# EAGLE design cmoy (EAGLE 4.16)
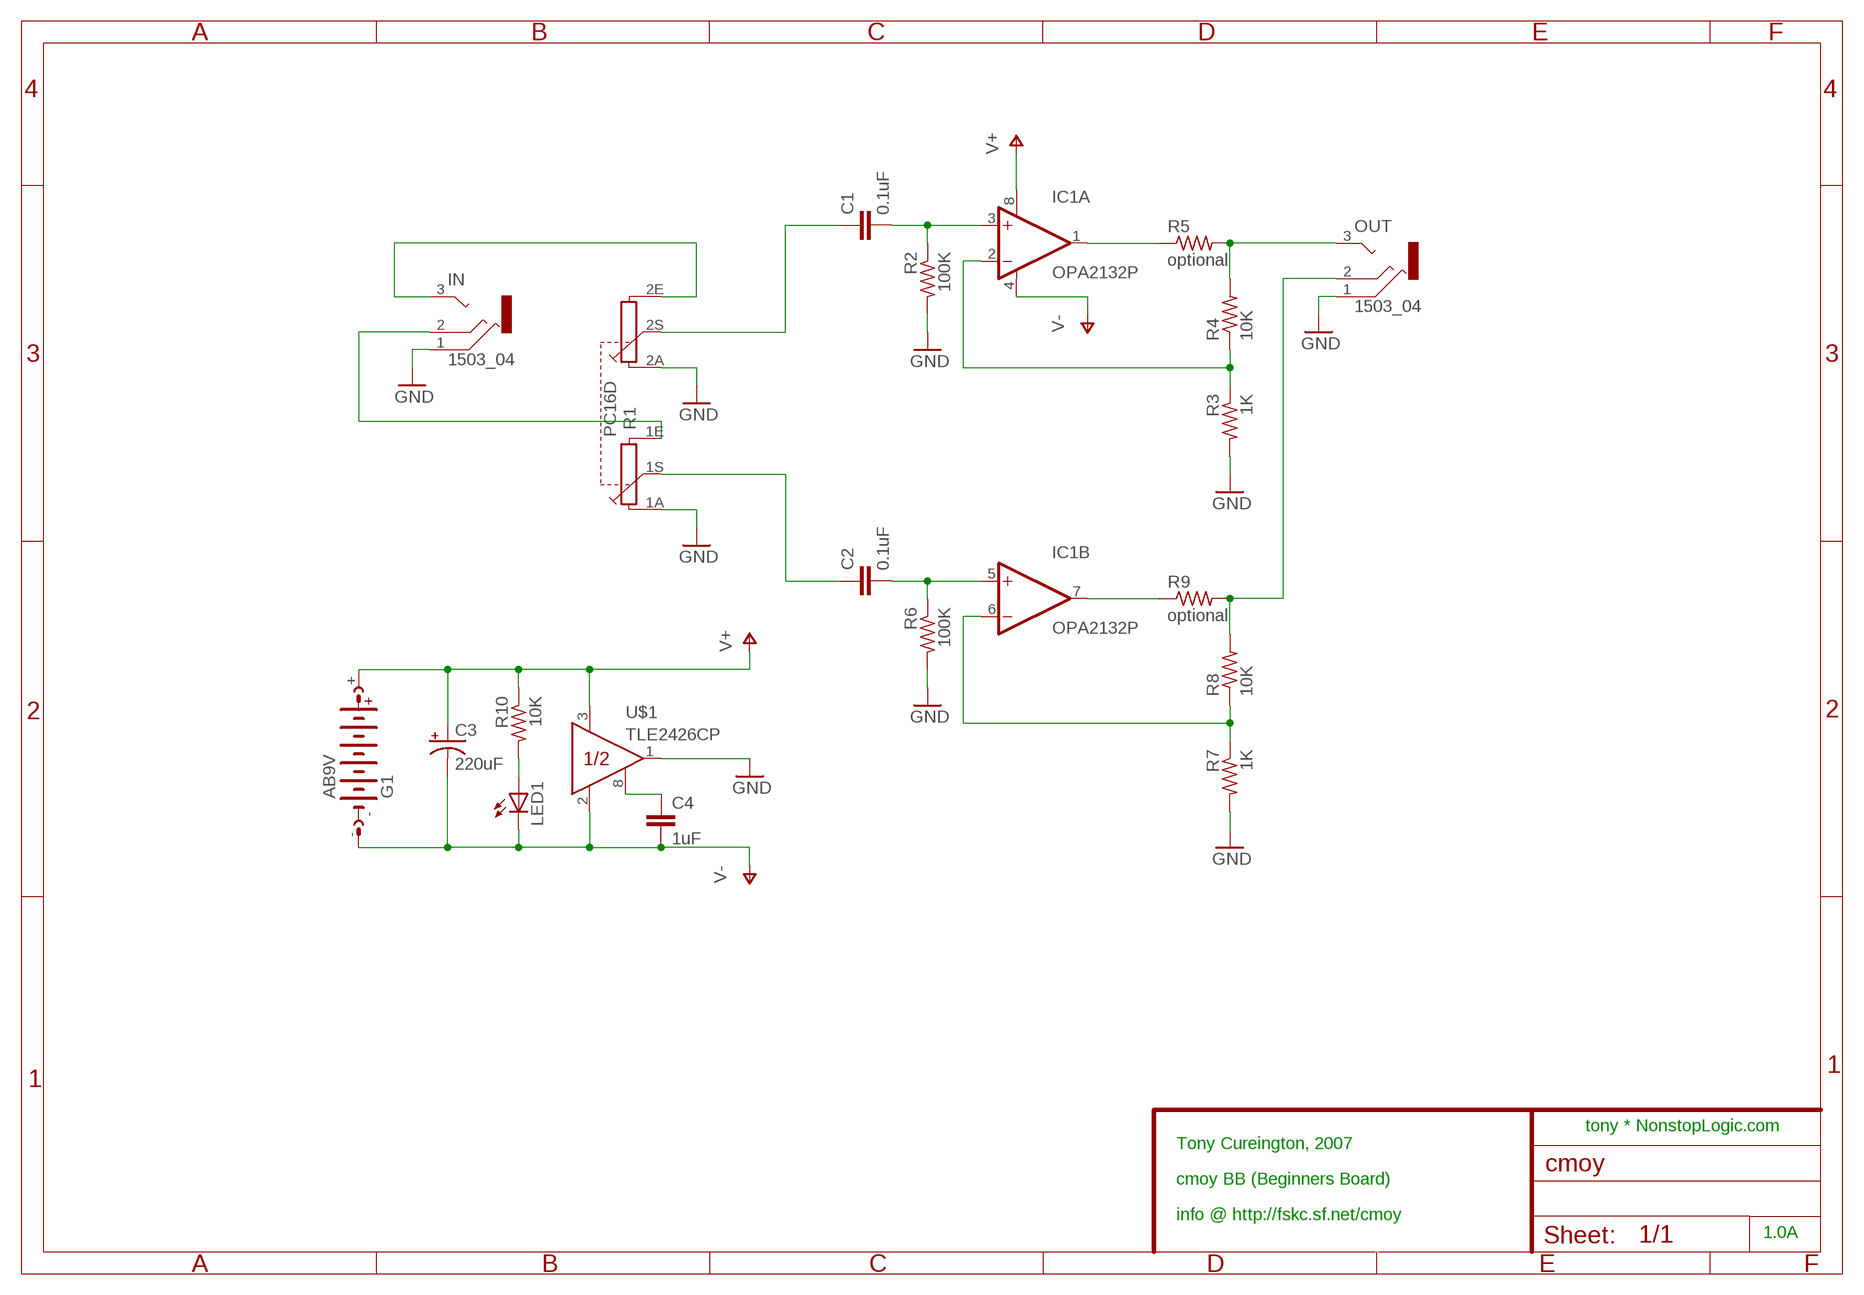
[diagram p0: schematic, sheet 1]

## Parts
C1  0.1uF  C15/5  [C15B5]
C2  0.1uF  C15/5  [C15B5]
C3  220uF  CPOL-USE3.5-8  [E3,5-8]
C4  1uF  C5/2.5  [C5B2.5]
G1  AB9V  [AB9V]
IC1  OPA2132P  [DIL08]
IN  1503_04  [1503_04]
LED1  LED3MM  [LED3MM]
OUT  1503_04  [1503_04]
R1  PC16D  [PC16D]
R2  100K  R-US_0207/10  [0207/10]
R3  1K  R-US_0207/10  [0207/10]
R4  10K  R-US_0207/10  [0207/10]
R5  optional  R-US_0207/10  [0207/10]
R6  100K  R-US_0207/10  [0207/10]
R7  1K  R-US_0207/10  [0207/10]
R8  10K  R-US_0207/10  [0207/10]
R9  optional  R-US_0207/10  [0207/10]
R10  10K  R-US_0207/10  [0207/10]
U$1  TLE2426CP  [DIP-8]

## Nets
N$1: IC1.1(A:OUT) R5.1
N$2: OUT.3 R4.2 R5.2
N$3: IC1.2(A:-IN) R3.1 R4.1
N$4: C1.2 IC1.3(A:+IN) R2.1
N$5: IC1.7(B:OUT) R9.1
N$6: OUT.2 R8.2 R9.2
N$7: IC1.6(B:-IN) R7.1 R8.1
N$8: C2.2 IC1.5(B:+IN) R6.1
N$9: IN.1 OUT.1 R1.1A R1.2A R2.2 R3.2 R6.2 R7.2 U$1.1(OUT) ; supply symbol labelled GND
N$11: LED1.A R10.2
N$12: IN.3 R1.2E
N$13: C4.1 U$1.8(NR)
N$14: IN.2 R1.1E
N$15: C1.1 R1.2S
N$16: C2.1 R1.1S
V+: C3.+ G1.+ IC1.8(A:V+) R10.1 U$1.3(IN)
V-: C3.- C4.2 G1.- IC1.4(A:V-) LED1.K(C) U$1.2(COM)

## Notes on the sheet
- tony * NonstopLogic.com
- Tony Cureington, 2007
- cmoy BB (Beginners Board)
- info @ http://fskc.sf.net/cmoy
- 1.0A

## Library data of the parts
C1 C2 C4 = capacitor-wima:C: CAPACITOR naming: grid - package width
C3 = rcl:CPOL-US: POLARIZED CAPACITOR, American symbol
G1 = battery:AB9V: 9-V BATTERY CLIP
IC1 = burr-brown:OPA2132: High Speed FET-Input Operational Amplifiers< Product Folder:OPA2132
IN OUT = con-lumberg:1503_04: Jack connectors according to JISC 6560, 3.5 mm, IP 57 Klinkensteckverbinder nach JISC 6560, 3,5 mm, IP 57 Source: http://www.lumberg.com/Produkte/PDFs/1503_04.pdf
LED1 = led:LED: LED OSRAM: - CHIPLED LG R971, LG N971, LY N971, LG Q971, LY Q971, LO R971, LY R971 LH N974, LH R974 LS Q976, LO Q976, LY Q976 LO Q996 - Hyper CHIPLED LW Q18S LB Q993, LB Q99A, LB R99A - SideLED LS A670, LO A670, LY A670, LG A670, LP A670 LB A673, LV A673, LT A673, LW A673 LH A674 LY A675 LS A676, LA A676, LO A676, LY A676, LW A676 LS A679, LY A679, LG A679 - Hyper Micro SIDELED® LS Y876, LA Y876, LO Y876, LY Y876 LT Y87S - SmartLED LW L88C, LW L88S LB L89C, LB L89S, LG L890 LS L89K, LO L89K, LY L89K LS L896, LA L896, LO L896, LY L896 - TOPLED LS T670, LO T670, LY T670, LG T670, LP T670 LSG T670, LSP T670, LSY T670, LOP T670, LYG T670 LG T671, LOG T671, LSG T671 LB T673, LV T673, LT T673, LW T673 LH T674 LS T676, LA T676, LO T676, LY T676, LB T676, LH T676, LSB T676, LW T676 LB T67C, LV T67C, LT T67C, LS T67K, LO T67K, LY T67K, LW E67C LS E67B, LA E67B, LO E67B, LY E67B, LB E67C, LV E67C, LT E67C LW T67C LS T679, LY T679, LG T679 LS T770, LO T770, LY T770, LG T770, LP T770 LB T773, LV T773, LT T773, LW T773 LH T774 LS E675, LA E675, LY E675, LS T675 LS T776, LA T776, LO T776, LY T776, LB T776 LHGB T686 LT T68C, LB T68C - Hyper Mini TOPLED® LB M676 - Mini TOPLED Santana® LG M470 LS M47K, LO M47K, LY M47K Source: http://www.osram.convergy.de - LUMILED® LXK2-PW12-R00, LXK2-PW12-S00, LXK2-PW14-U00, LXK2-PW14-V00 LXK2-PM12-R00, LXK2-PM12-S00, LXK2-PM14-U00 LXK2-PE12-Q00, LXK2-PE12-R00, LXK2-PE12-S00, LXK2-PE14-T00, LXK2-PE14-U00 LXK2-PB12-K00, LXK2-PB12-L00, LXK2-PB12-M00, LXK2-PB14-N00, LXK2-PB14-P00, LXK2-PB14-Q00 LXK2-PR12-L00, LXK2-PR12-M00, LXK2-PR14-Q00, LXK2-PR14-R00 LXK2-PD12-Q00, LXK2-PD12-R00, LXK2-PD12-S00 LXK2-PH12-R00, LXK2-PH12-S00 LXK2-PL12-P00, LXK2-PL12-Q00, LXK2-PL12-R00 Source: www.luxeon.com
R1 = piher:PC16D: POTENTIOMETER tandem carbon potentiometer, 16 mm, S3ROH
R2-R10 = rcl:R-US_: RESISTOR, American symbol
U$1 = tle2426:TLE2426*: Texas Instruments "rail splitter" with noise-reduction

## Net classes
0 default: width 1.397 mm

## Board
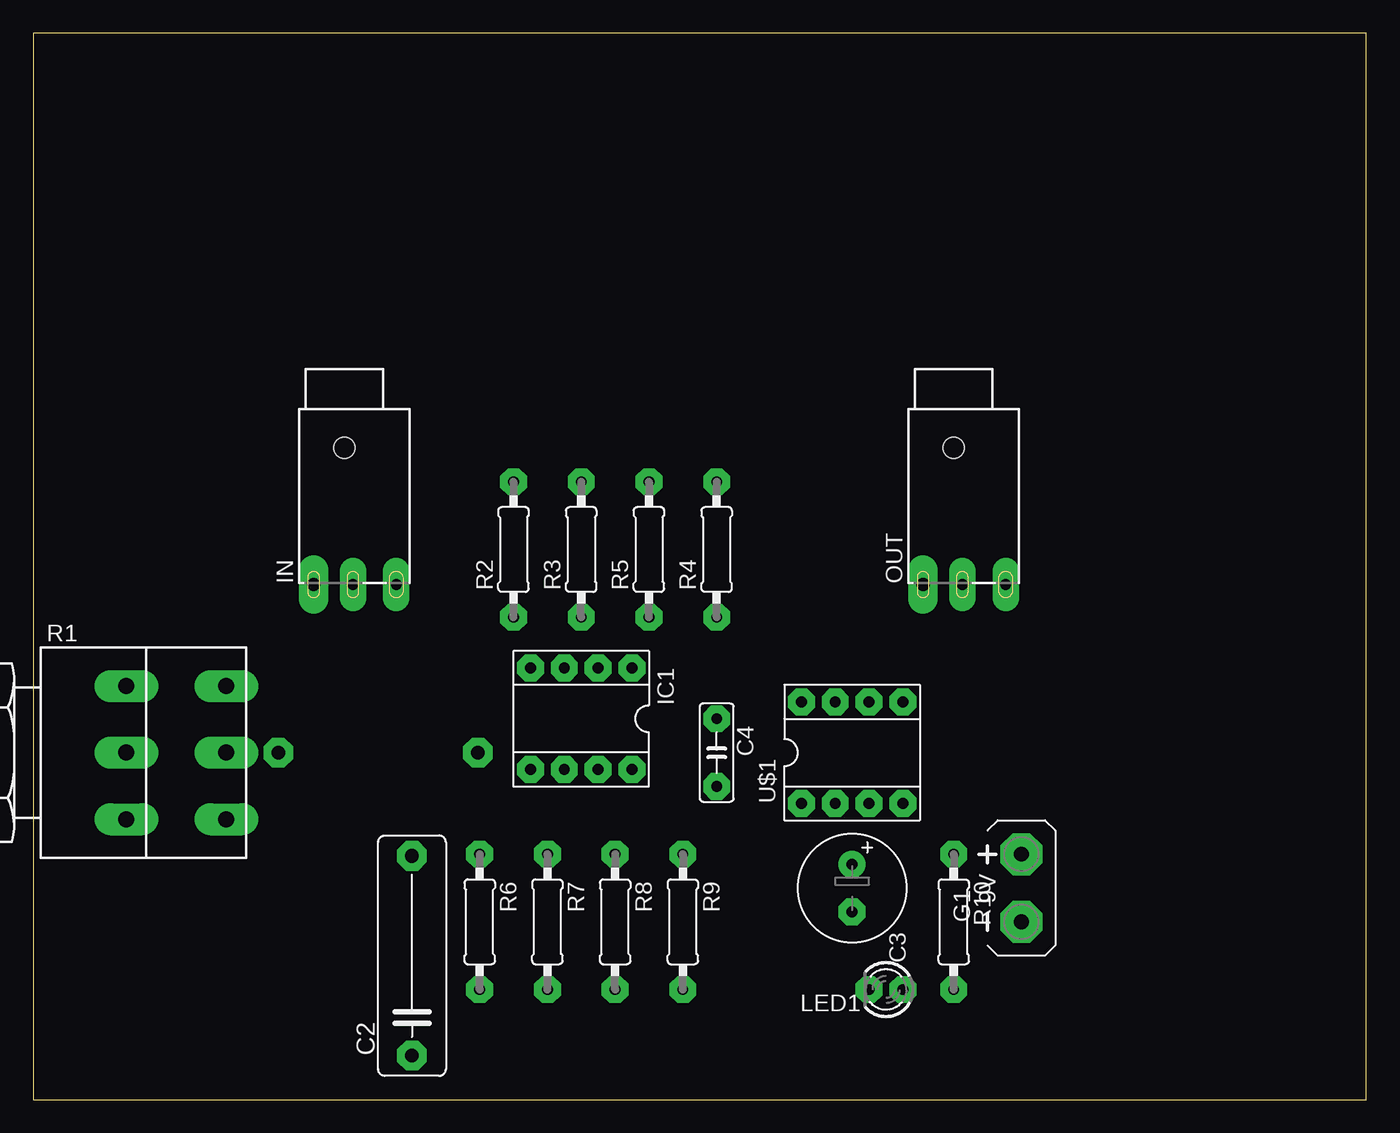
[diagram p1: board, top side]
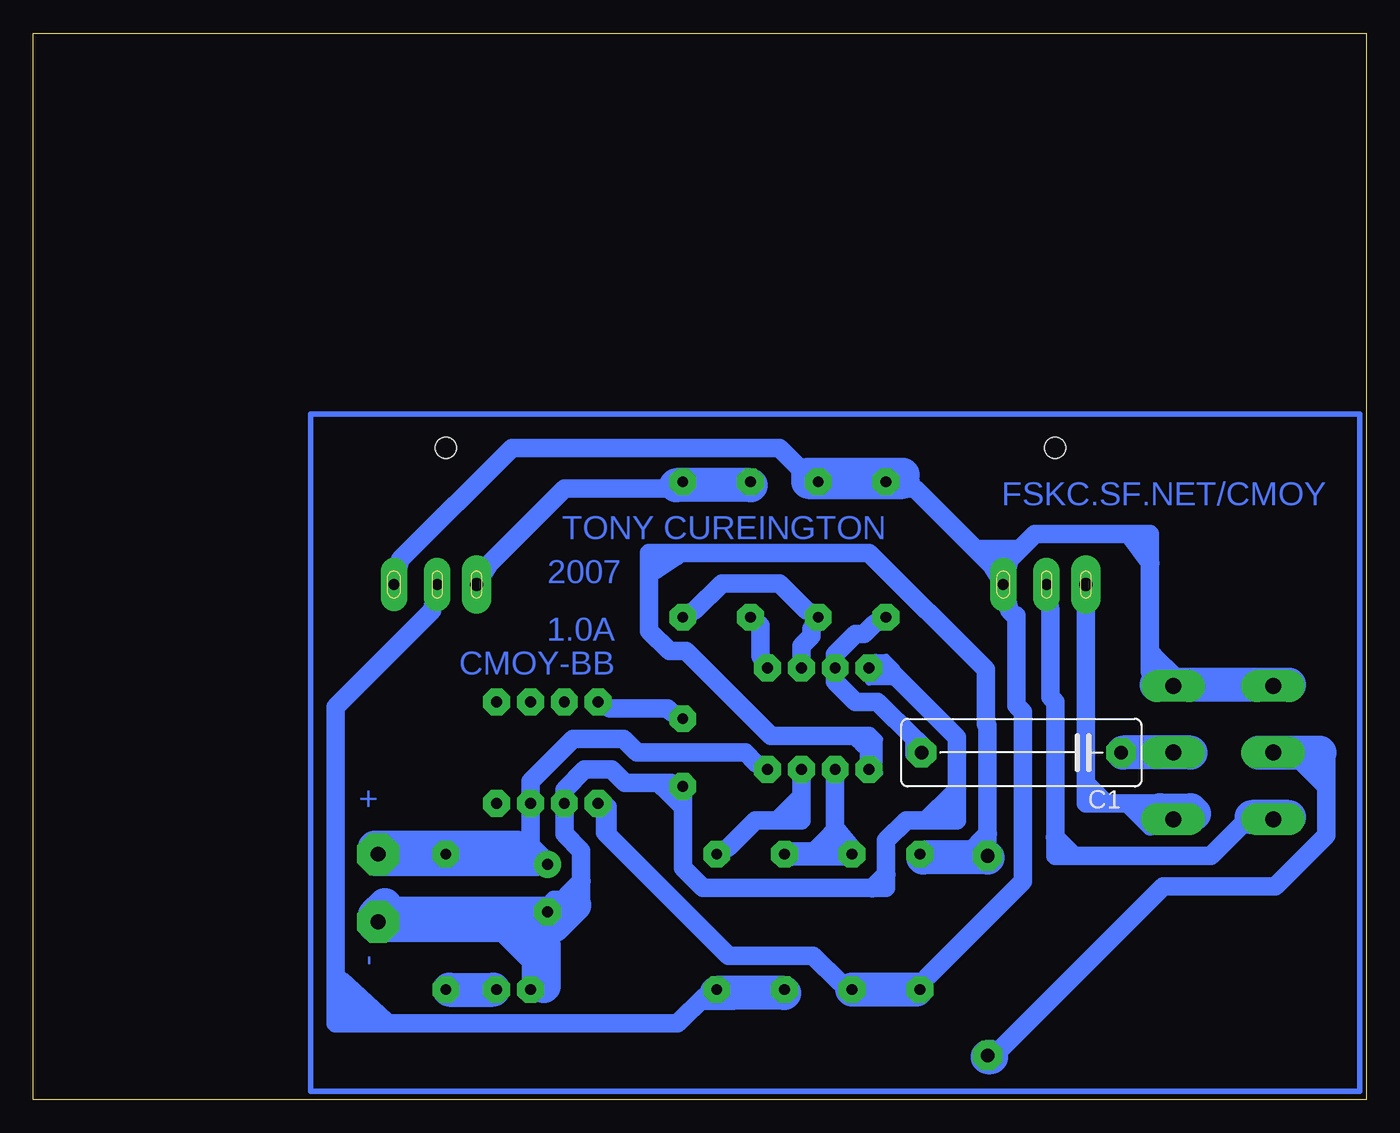
[diagram p2: board, bottom side, seen from below]

Size 100 x 80 mm. Coordinates in mm from the lower left corner, seen from the top.
Outline: 0,0 100,0 100,80 0,80 0,0
Copper layers 16: Bottom 0.035mm
Design rules "default": minimum track width 10mil, minimum drill 24mil, track to track 0.8mm, track to pad 0.8mm, pad to pad 0.45mm, via to via 0.8mm, smd to smd 8mil, copper to edge 40mil, drill to drill 8mil, minimum pad ring 0.6mm, minimum via ring 0.6mm, stop-mask expansion 4mil, vias tented up to drill 0mil, thermal gap 10mil

### Footprints (pad centres in the part's own frame; a part is rotated, then mirrored left to right if it is on the bottom)
C15B5 = drill 1.016 pad 2.159 octagon: 1 -7.493,0; 2 7.493,0
E3,5-8 = drill 0.813 pad 1.6 round: + -1.778,0 | drill 0.813 pad 1.6 octagon: - 1.778,0
C5B2.5 = drill 0.813 pad 1.6 octagon: 1 -2.54,0; 2 2.54,0
AB9V = drill 1.118 pad 3.15 octagon: + 0,2.54; - 0,-2.54
DIL08 = drill 0.813 pad 1.6 octagon: 1 -3.81,-3.81; 2 -1.27,-3.81; 3 1.27,-3.81; 4 3.81,-3.81; 5 3.81,3.81; 6 1.27,3.81; 7 -1.27,3.81; 8 -3.81,3.81
1503_04 = drill 0.8 pad 1.2 long: 1 3.9,-10.25; 2 0.65,-10.25 | drill 1 pad 1.2 long: 3 -2.3,-10.25 | hole 1.6: 0,0
LED3MM = drill 0.813 octagon: A -1.27,0; K 1.27,0
PC16D = drill 1.2 long: 1A -5,6.5; 1E 5,6.5; 1S 0,6.5; 2A -5,14; 2E 5,14; 2S 0,14
0207/10 = drill 0.813 octagon: 1 -5.08,0; 2 5.08,0
DIP-8 = drill 0.813 pad 1.6 octagon: 1 -3.81,3.81; 2 -3.81,1.27; 3 -3.81,-1.27; 4 -3.81,-3.81; 5 3.81,-3.81; 6 3.81,-1.27; 7 3.81,1.27; 8 3.81,3.81

### Placement (x,y rotation side)
C1  25.87,26.03 180 bottom
C2  28.41,10.79 90 top
C3  61.43,15.87 270 top
C4  51.27,26.03 270 top
G1  74.13,15.87 0 top
IC1  41.11,28.57 180 top
IN  23.33,48.89 0 top
LED1  63.97,8.25 180 top
OUT  69.05,48.89 0 top
R1  0.47,26.03 270 top
R2  36.03,41.27 90 top
R3  41.11,41.27 90 top
R4  51.27,41.27 90 top
R5  46.19,41.27 90 top
R6  33.49,13.33 270 top
R7  38.57,13.33 270 top
R8  43.65,13.33 270 top
R9  48.73,13.33 270 top
R10  69.05,13.33 270 top
U$1  61.43,26.03 90 top

### Tracks (layer width: path | path; a pad name or v marks a point on that pad's centre or on a via)
N$1
  Bottom 1.397: IC1.1 45.43,33.27 45.43,35.55 R5.1
N$2
  Bottom 1.397: R5.2 R4.2 52.16,45.84 60.16,45.84 65.75,40.25 OUT.3
N$3
  Bottom 1.397: IC1.2 42.38,34.03 41.62,34.79 41.62,35.3 R3.1 42,36.7 44.03,38.73 48.35,38.73 50.38,36.7 R4.1
N$4
  Bottom 1.397: R2.1 36.92,35.68 37.68,34.92 38.32,34.92 39.84,33.4 IC1.3 39.84,31.36 38.32,29.84 36.66,29.84 33.87,27.05 C1.2
N$5
  Bottom 1.397: IC1.7 42.38,20.95 44.16,20.95 45.81,20.95 47.84,18.92 R9.1
  Bottom 1.422: 42.63,22.47 44.16,20.95
N$6
  Bottom 1.397: OUT.2 70.07,36.7 77.3,29.46 77.3,5.71 51.65,5.71 49.62,7.74 R9.2 R8.2
N$7
  Bottom 1.397: R7.1 39.84,18.41 | 39.84,18.41 R8.1 | 39.84,18.41 IC1.6
N$8
  Bottom 1.397: R6.1 29.93,18.41 29.43,18.41 C2.2 28.41,19.93 28.41,28.06 28.54,28.19 28.54,32.25 37.3,41.02 53.81,41.02 53.81,35.17 52.29,33.65 51.02,33.65 44.67,27.3 37.3,27.3 IC1.5
  Bottom 1.422: 28.41,19.93 29.93,18.41
N$9
  Bottom 1.397: OUT.1 72.48,40.51 64.1,48.89 44.03,48.89 42,46.86 R3.2 R2.2 35.14,45.84 33.87,45.84 28.16,40.13 IN.1 | 33.74,8.25 R6.2 32.98,9.14 25.74,16.38 25.74,29.08 26.25,29.59 26.25,36.32 26.38,36.32 26.76,36.7 IN.1 | U$1.1 57.11,21.33 57.11,20.06 47.84,10.79 41.49,10.79 39.46,8.76 R7.2 | R1.1A 9.36,31.11 12.15,31.11 R1.2A 16.22,32.13 16.22,40.25 16.22,42.41 24.85,42.41 26.76,40.51 IN.1
  Bottom 1.422: 17.74,42.29 16.22,40.25
  Bottom 2.54: 33.74,8.25 R7.2
N$10
  Bottom 0.406: 79.21,51.43 0.47,51.43 0.47,0.63 79.21,0.63 79.21,51.43
N$11
  Bottom 1.397: LED1.A 65.49,8.25 | 68.8,8.25 R10.2
  Bottom 2.54: 68.8,8.25 65.49,8.25
N$12
  Bottom 1.397: IN.3 21.04,36.44 21.04,22.22 19.52,22.22 16.09,22.22 R1.2E
  Bottom 1.422: 19.52,22.22 20.79,23.49
N$13
  Bottom 1.397: C4.1 52.16,29.08 52.41,29.33 56.73,29.33 U$1.8
N$14
  Bottom 1.397: IN.2 23.71,36.7 23.71,30.22 23.33,29.84 23.33,19.68 23.33,18.28 11.65,18.28 9.36,20.57 R1.1E
  Bottom 1.422: 22.06,18.41 23.33,19.68
N$15
  Bottom 1.397: R1.2S 18.25,26.03 C1.1
  Bottom 2.54: 13.17,26.03 18.25,26.03
N$16
  Bottom 1.397: C2.1 27.39,3.8 15.2,16 6.82,16 3.01,19.81 3.01,23.49 3.01,25.52 4.66,25.52 R1.1S
  Bottom 1.422: 3.01,23.49 5.55,26.03
N$17
  Bottom 1.422: 26.38,41.27 28.92,41.27
N$18
  Bottom 1.422: 37.55,26.54 38.06,27.05
N$19
  Bottom 1.422: 40.09,19.93 41.11,18.92
N$20
  Bottom 1.422: 39.59,19.93 39.08,18.92
N$21
  Bottom 1.422: 51.78,40.76 53.3,39.75
N$22
  Bottom 2.54: 5.8,31.11 15.71,31.11
N$23
  Bottom 2.54: 8.09,26.03 3.52,26.03
N$24
  Bottom 2.54: 12.92,21.46 15.46,21.46 15.46,21.71 13.17,21.71
N$25
  Bottom 2.54: 5.8,21.2 8.6,21.2
N$26
  Bottom 2.54: 34.76,46.86 41.87,46.86 41.87,46.35 34.76,46.35
N$27
  Bottom 2.54: 46.19,46.1 51.78,46.1
N$28
  Bottom 2.54: 74.38,18.92 63.72,18.92
N$29
  Bottom 1.27: 73.62,14.6 59.4,14.6
  Bottom 2.54: 74.38,13.84 73.62,14.6 | 59.4,14.6 60.92,13.08 74.38,13.08
N$30
  Bottom 2.54: 43.65,8 48.73,8
N$31
  Bottom 2.54: 28.41,18.16 33.24,18.16
N$32
  Bottom 1.27: 38.32,18.66 39.59,20.19
N$33
  Bottom 1.27: 38.57,18.16 43.14,18.16
N$34
  Bottom 1.27: 40.86,18.66 43.14,18.66
N$35
  Bottom 2.54: 61.68,8.5 61.68,11.55
N$36
  Bottom 1.27: 77.18,7.74 75.15,5.96
N$37
  Bottom 1.27: 76.92,9.01 73.62,5.96
N$38
  Bottom 0.61: 32.73,26.54 33.49,27.3
N$39
  Bottom 0.61: 34.25,25.78 34.25,26.79
N$40
  Bottom 0.61: 36.54,24.51 36.54,27.05 37.05,27.55
N$41
  Bottom 0.61: 36.79,33.14 36.03,33.14 35.27,32.38
N$42
  Bottom 0.61: 35.52,31.36 37.3,31.36
N$43
  Bottom 1.27: 62.19,17.39 74.38,17.39
N$44
  Bottom 1.016: 47.46,7.23 49.75,7.23
N$45
  Bottom 2.54: 28.41,3.17 28.16,3.17
N$46
  Bottom 1.27: 14.19,31.62 15.96,33.4
N$47
  Bottom 1.27: 16.22,20.44 17.74,21.97
N$48
  Bottom 1.27: 62.7,8.76 62.7,10.28 64.99,12.57
N$49
  Bottom 1.27: 62.45,18.92 61.68,18.16
N$50
  Bottom 1.27: 56.86,19.93 56.86,21.97
V+
  Bottom 0.61: 74.38,17.9 62.45,17.9
  Bottom 1.397: 62.7,17.9 64.48,17.9 68.16,17.9 R10.1 G1.+ | 62.7,17.9 62.45,17.9 62.32,17.9 C3.+ | IC1.8 45.81,25.27 46.57,26.03 54.7,26.03 55.71,27.05 59.52,27.05 62.7,23.87 U$1.3 62.7,17.9
  Bottom 1.422: 62.95,19.43 64.48,17.9
V-
  Bottom 1.27: 63.97,13.33 G1.-
  Bottom 1.397: 62.19,13.2 62.19,9.14 LED1.K | 62.19,13.2 61.94,13.2 C3.- 60.92,14.98 58.89,14.98 58.89,16.38 58.89,18.66 60.16,19.93 U$1.2 60.16,23.24 58.64,24.76 56.6,24.76 55.59,23.74 52.16,23.74 C4.2 51.27,21.97 51.27,17.39 49.75,15.87 37.05,15.87 36.03,15.87 36.03,16.89 36.03,19.43 34.51,20.95 32.98,20.95 30.7,20.95 30.7,27.17 35.65,32.13 36.41,32.13 IC1.4 | 63.97,13.33 62.83,13.33 62.19,13.2
  Bottom 1.422: 58.89,16.38 59.91,15.36 | 62.45,11.81 63.97,13.33 | 51.27,21.97 52.79,23.49 | 30.95,22.98 32.98,20.95 | 36.03,16.89 37.05,15.87

### Text on the board
Bottom: FSKC.SF.NET/CMOY | TONY CUREINGTON | 2007 | 1.0A | CMOY-BB | + | -